# EasyEDA Pro project ProDoc_PCB1_2024-07-10.epro

# Board PCB1
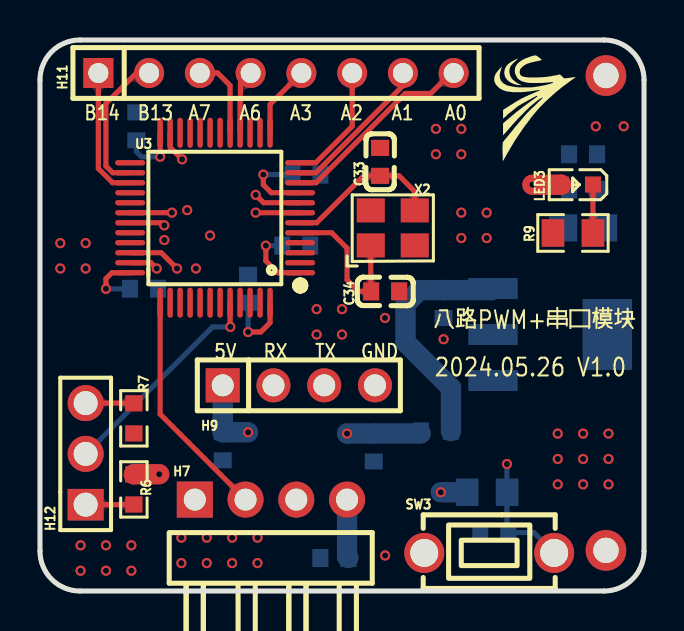
[diagram p0: board, top side]
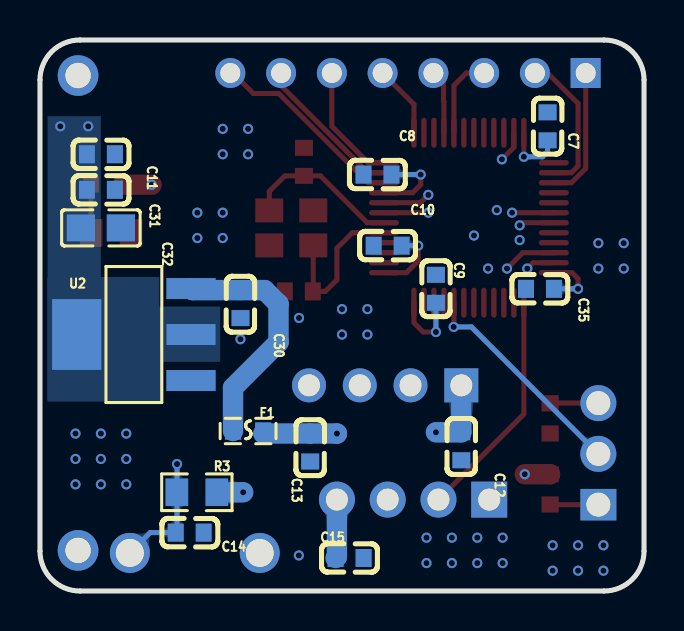
[diagram p1: board, bottom side, seen from below]

Outline 30.23 x 27.56 mm; copper layers: Top Layer, Inner1, Inner2, Bottom Layer. Coordinates in mm from the lower left corner of the outline.
Outline path: 0,25.56 0,2 arc(0.59,0.59) 2,0 28.23,0 arc(29.64,0.59) 30.23,2 30.23,25.56 arc(29.64,26.97) 28.23,27.56 2,27.56 arc(0.59,26.97) 0,25.56
Stack: Top Layer 0.035mm 外层铜厚1oz / Dielectric1 0.2104mm 7628 RC49% 8.6mil / Inner1 0.0152mm 内层铜厚 / Dielectric2 1.065mm 1.1mm H/HOZ 含铜 / Inner2 0.0152mm 内层铜厚 / Dielectric3 0.2104mm 7628 RC49% 8.6mil / Bottom Layer 0.035mm 外层铜厚1oz

## Design rules (mm)
net OSC_IN: DP1
net OSC_OUT: DP1
template: JLCPCB Capability(Two Layers Board)
spacing copperThickness1oz (default): track to track 0.102, other pairs 0.152 to 0.3
spacing copperThickness2oz: track to track 0.203, other pairs 0.152 to 0.3
track width copperThickness1oz (default): min 0.127, default 0.254, max 2.54
track width copperThickness2oz: min 0.203, default 0.254, max 2.54
differential pair differentialPair (default): width min 0.127, default 0.254, max 2.54; gap min 0.152, default 0.152
via viaSize (default): diameter min 0.5, default 0.61, max 10; hole min 0.3, default 0.305, max 6.3

## Placement (name value [footprint] x y rotation side)
C7  100nF  [C0603]  4.83 23.24 270 bottom
C8  100nF  [C0603]  13.34 20.83 180 bottom
C9  100nF  [C0603]  10.41 15.11 270 bottom
C10  100nF  [C0603]  12.83 17.27 180 bottom
C11  22uF  [C0603]  27.18 21.84 0 bottom
C12  22uF  [C0603]  9.14 7.24 90 bottom
C13  100nF  [C0603]  16.7 7.18 90 bottom
C14  100nF  [C0603]  22.73 2.92 0 bottom
C15  100nF  [C0603]  14.73 1.65 180 bottom
C30  100nF  [C0603]  20.19 14.35 90 bottom
C31  100nF  [C0603]  27.18 20.07 0 bottom
C32  10uF  [C0805]  27.18 18.16 0 bottom
C33  20pF  [C0603]  17.02 21.46 270 top
C34  20pF  [C0603]  17.27 14.99 180 top
C35  100nF  [C0603]  5.21 15.11 180 bottom
F1  ASMD0603-035  [F0603]  19.81 8 0 bottom
H7  2.54-1*4P反弯排针  [HDR-TH_4P-P2.54-H-M-W10.4]  11.56 4.57 0 top
H9  PZ254V-11-04P  [HDR-TH_4P-P2.54-V-M]  12.95 10.29 0 top
H11  PZ254V-11-08P  [HDR-TH_8P-P2.54-V-M]  11.81 25.91 0 top
H12  2.54-1*3P针  [HDR-TH_3P-P2.54-V-M-1]  2.29 6.86 90 top
LED3  NCD0603R1  [LED0603-RD_RED]  26.87 20.33 180 top
NOREF  -  [Pad_e3583]  28.32 2.03 0 top
NOREF#2  -  [Pad_e3581]  28.32 25.78 0 top
R3  10kΩ  [R0805]  22.38 4.94 180 bottom
R6  10kΩ  [R0603]  4.7 5.08 90 top
R7  10kΩ  [R0603]  4.7 8.64 90 top
R9  1kΩ  [R0805]  26.67 17.91 0 top
SW3  UK-B0205G43-DP25Y  [KEY-TH_L6.0-W3.5-P6.50]  22.48 1.91 0 top
U2  SK1117-3.3  [SOT-223_L6.5-W3.5-P2.30-LS7.0-BR]  25.53 12.83 180 bottom
U3  STM32L051C8T6  [LQFP-48_L7.0-W7.0-P0.50-LS9.0-BL]  8.76 18.67 90 top
X2  8MHz  [OSC-SMD_4P-L3.2-W2.5-BL]  17.65 18.16 0 top

## Footprints (pads in the part's own frame, mm; a bottom-side part is the same pattern mirrored in y, then rotated)
C0603
  rect 0.8x0.9 smd: 1(-0.7,0) 2(0.7,0)
C0805
  rect 1.41x1.35 smd: 1(-1,0) 2(1,0)
F0603
  rect 0.806x0.864 smd: 1(-0.753,0) 2(0.753,0)
HDR-TH_3P-P2.54-V-M-1
  rect 1.575x1.8 hole 1.2: 1(-2.54,0)
  round 1.8 hole 1.2: 2(0,0) 3(2.54,0)
HDR-TH_4P-P2.54-H-M-W10.4
  rect 1.8x1.8 hole 1.1: 1(-3.81,0)
  round 1.8 hole 1.1: 2(-1.27,0) 3(1.27,0) 4(3.81,0)
HDR-TH_4P-P2.54-V-M
  rect 1.7x1.7 hole 1.1: 1(-3.81,0)
  round 1.7 hole 1.1: 2(-1.27,0) 3(1.27,0) 4(3.81,0)
HDR-TH_8P-P2.54-V-M
  rect 1.5x1.5 hole 1: 1(-8.89,0)
  round 1.5 hole 1: 2(-6.35,0) 3(-3.81,0) 4(-1.27,0) 5(1.27,0) 6(3.81,0) 7(6.35,0) 8(8.89,0)
KEY-TH_L6.0-W3.5-P6.50
  round 2 hole 1.4: 1(-3.25,0) 2(3.25,0)
LED0603-RD_RED
  rect 0.8x0.8 smd: 1(-0.799,-0.004) 2(0.799,0.004)
LQFP-48_L7.0-W7.0-P0.50-LS9.0-BL
  oval 0.27x1.5 smd: 1(-2.75,-4.25) 2(-2.25,-4.25) 3(-1.75,-4.25) 4(-1.25,-4.25) 5(-0.75,-4.25) 6(-0.25,-4.25) 7(0.25,-4.25) 8(0.75,-4.25) 9(1.25,-4.25) 10(1.75,-4.25) 11(2.25,-4.25) 12(2.75,-4.25) 25(2.75,4.25) 26(2.25,4.25) 27(1.75,4.25) 28(1.25,4.25) 29(0.75,4.25) 30(0.25,4.25) 31(-0.25,4.25) 32(-0.75,4.25) 33(-1.25,4.25) 34(-1.75,4.25) 35(-2.25,4.25) 36(-2.75,4.25)
  oval 1.5x0.27 smd: 13(4.25,-2.75) 14(4.25,-2.25) 15(4.25,-1.75) 16(4.25,-1.25) 17(4.25,-0.75) 18(4.25,-0.25) 19(4.25,0.25) 20(4.25,0.75) 21(4.25,1.25) 22(4.25,1.75) 23(4.25,2.25) 24(4.25,2.75) 37(-4.25,2.75) 38(-4.25,2.25) 39(-4.25,1.75) 40(-4.25,1.25) 41(-4.25,0.75) 42(-4.25,0.25) 43(-4.25,-0.25) 44(-4.25,-0.75) 45(-4.25,-1.25) 46(-4.25,-1.75) 47(-4.25,-2.25) 48(-4.25,-2.75)
OSC-SMD_4P-L3.2-W2.5-BL
  rect 1.4x1.2 smd: 1(-1.1,-0.875) 2(1.1,-0.875) 3(1.1,0.875) 4(-1.1,0.875)
Pad_e3581
  round 2.032 hole 1.27: 1(0,0)
Pad_e3583
  round 2.032 hole 1.27: 1(0,0)
R0603
  rect 0.806x0.864 smd: 1(-0.753,0) 2(0.753,0)
R0805
  rect 1.133x1.377 smd: 1(-1,0) 2(1,0)
SOT-223_L6.5-W3.5-P2.30-LS7.0-BR
  rect 2.465x1.05 smd: 1(2.857,-2.3) 2(2.857,0) 3(2.857,2.3)
  rect 2.465x3.54 smd: 4(-2.857,0)

## Nets
3V3: C7.2 C8.2 C9.2 C10.2 C11.2 C15.1 C31.2 C32.2 C35.2 H7.4 LED3.2 R3.2 R6.2 U2.2 U2.4 U3.1 U3.9 U3.24 U3.36 U3.48
+5V: C12.2 C13.2 F1.1 H9.1
GND: C7.1 C8.1 C9.1 C10.1 C11.1 C12.1 C13.1 C14.1 C15.2 C30.1 C31.1 C32.1 C33.1 C34.1 C35.1 H7.1 H9.4 NOREF.1 NOREF#2.1 R7.1 R9.1 SW3.1 U2.1 U3.8 U3.23 U3.35 U3.47 X2.2 X2.4
BOOT0: H12.2 U3.44
NRST: C14.2 R3.1 SW3.2 U3.7
OSC_IN: C34.2 U3.5 X2.1
OSC_OUT: C33.2 U3.6 X2.3
PA0: H11.8 U3.10
PA1: H11.7 U3.11
PA2: H11.6 U3.12
PA3: H11.5 U3.13
PA6: H11.4 U3.16
PA7: H11.3 U3.17
PA9: H9.3 U3.30
PA10: H9.2 U3.31
PA13: H7.3 U3.34
PA14: H7.2 U3.37
PB13: H11.2 U3.26
PB14: H11.1 U3.27
$1N2833: C30.2 F1.2 U2.3
$1N2835: LED3.1 R9.2
$1N5934: H12.1 R6.1
$1N5935: H12.3 R7.2

Pads without a net: U3 2 3 4 14 15 18 19 20 21 22 25 28 29 32 33 38 39 40 41 42 43 45 46

## Via types
v1: diameter 0.508, hole 0.305, Top Layer to Bottom Layer, 67 vias

## Routing (per net, layer and track width the routed paths; a pad name or vN(x,y) marks a point on that pad's centre or on a via; arc(x,y) is an arc through that point)
3V3: length 24.4
  Top Layer w0.254: U3.1 11.89,15.92 11.3,16.51 v1(11.3,17.27) ; U3.24 v1(6.01,21.72) ; v1(11.18,20.83) 11.18,20.32 11.58,19.92 U3.9 ; U3.48 11.51,13.42 11.05,12.95 v1(10.41,12.95) ; U3.36 3.6,15.92 3.3,15.62 v1(3.3,15.11)
  Top Layer w1.016: v1(5.97,5.84) 4.71,5.84 R6.2 ; LED3.2 26.07,20.32 v1(24.64,20.32)
  Bottom Layer w0.254: 4.63,15.11 v1(3.3,15.11) ; 12.51,20.83 v1(11.18,20.83) ; C7.2 4.83,21.97 5.08,21.72 v1(6.01,21.72) ; C9.2 v1(10.41,12.95) ; C10.2 v1(11.3,17.27)
  Bottom Layer w1.016: H7.4 15.37,1.72 C15.1 ; R3.2 v1(20.06,4.94)
  vias: v1(27.81,23.24) v1(29.21,23.24)
+5V: length 7.3
  Bottom Layer w1.016: 19.05,7.88 C13.2 15.37,7.88 v1(15.37,7.87) ; H9.1 9.14,7.94 v1(10.41,7.94)
GND: length 5.4
  Top Layer w0.254: v1(7.11,21.59) 6.51,22.19 U3.23 ; v1(5.84,16.13) 5.55,16.42 U3.35 ; v1(10.8,19.81) 11.19,19.42 U3.8
  vias: v1(1.02,17.4) v1(1.02,16.13) v1(2.03,2.29) v1(2.03,1.02) v1(2.29,17.4) v1(2.29,16.13) v1(3.3,2.29) v1(3.3,1.02) v1(4.57,2.29) v1(4.57,1.02) v1(6.22,17.55) v1(7.08,2.67) v1(7.08,1.4) v1(7.37,19.05) v1(7.81,16.13) v1(8.34,2.67) v1(8.34,1.4) v1(8.51,17.78) v1(9.62,2.67) v1(9.62,1.4) v1(10.89,2.67) v1(10.89,1.4) v1(13.84,14.1) v1(13.84,12.83) v1(15.11,14.1) v1(15.11,12.83) v1(17.26,13.66) v1(17.27,1.78) v1(19.81,23.11) v1(19.81,21.84) v1(20.2,12.59) v1(21.08,23.11) v1(21.08,21.84) v1(21.08,18.92) v1(21.08,17.65) v1(22.35,18.92) v1(22.35,17.65) v1(25.91,7.87) v1(25.91,6.6) v1(25.91,5.33) v1(27.18,7.87) v1(27.18,6.6) v1(27.18,5.33) v1(28.45,7.87) v1(28.45,6.6) v1(28.45,5.33)
BOOT0: length 11.1
  Top Layer w0.254: v1(9.53,13.21) 9.51,13.22 U3.44
  Bottom Layer w0.254: H12.2 8.64,13.21 v1(9.53,13.21)
NRST: length 29.1
  Top Layer w0.254: U3.7 10.8,18.92 v1(10.8,18.92)
  Inner1 w0.254: v1(10.8,18.92) 15.62,18.92 23.37,11.18 v1(23.37,6.35)
  Bottom Layer w0.254: 23.37,4.95 23.37,2.92 24.71,2.92 SW3.2 ; 23.37,4.95 R3.1 ; 23.37,4.95 v1(23.37,6.35)
OSC_IN: length 8
  Top Layer w0.254: U3.5 14.59,17.92 15.37,17.14 15.37,15.56 15.95,14.99 16.55,14.99 X2.1
OSC_OUT: length 8
  Top Layer w0.254: X2.3 18.75,19.98 17.97,20.76 C33.2 16.19,20.76 13.85,18.42 U3.6
PA0: length 10
  Top Layer w0.254: U3.10 13.81,20.42 18.28,24.89 19.55,24.89 20.57,25.91 H11.8
PA1: length 7.6
  Top Layer w0.254: H11.7 18.16,25.27 13.81,20.92 U3.11
PA2: length 6
  Top Layer w0.254: U3.12 13.8,21.42 15.62,23.24 H11.6
PA3: length 3.6
  Top Layer w0.254: H11.5 11.51,24.34 U3.13
PA6: length 3.2
  Top Layer w0.254: U3.16 10.01,24.49 10.03,24.51 10.03,25.4 H11.4
PA7: length 4.1
  Top Layer w0.254: H11.3 8.89,25.91 9.51,25.28 U3.17
PA9: length 13.9
  Top Layer w0.254: U3.30 4.52,18.92 v1(6.6,18.92)
  Inner1 w0.254: v1(6.6,18.92) 14.22,11.3 H9.3
PA10: length 12.3
  Top Layer w0.254: U3.31 6.09,18.42 v1(6.22,18.29)
  Inner1 w0.254: v1(6.22,18.29) 6.73,18.29 11.68,13.33 H9.2
PA13: length 17.1
  Top Layer w0.254: v1(6.86,16.13) 6.07,16.92 U3.34
  Inner1 w0.254: v1(6.86,16.13) 6.86,9.91 12.19,4.57 H7.3
PA14: length 11.6
  Top Layer w0.254: U3.37 6.01,8.85 H7.2
PB13: length 7.3
  Top Layer w0.254: U3.26 3.64,20.92 3.3,21.25 3.3,24.38 4.83,25.91 H11.2
PB14: length 6.7
  Top Layer w0.254: H11.1 2.92,21.13 3.63,20.42 U3.27
$1N2833: length 12
  Bottom Layer w1.016: F1.2 20.57,10.17 18.29,12.45 18.29,14.35 18.99,15.05 C30.2 22.59,15.05 U2.3
$1N2835: length 2.4
  Top Layer w0.254: 27.67,17.91 LED3.1
$1N5934: length 2.4
  Top Layer w0.254: H12.1 4.69,4.32 R6.1
$1N5935: length 2.4
  Top Layer w0.254: H12.3 4.69,9.4 R7.2

## Copper pours and planes (outline as drawn; the poured copper is in the pictures)
3V3 on Bottom Layer: 21.21,15.7 29.85,15.7 29.85,9.47 21.21,9.47
3V3 on Bottom Layer: 27.18,23.75 29.84,23.75 29.84,9.52 27.18,9.52
3V3 on Inner2: 0,27.56 30.1,27.56 30.1,0 0,0
+5V on Inner2: 7.62,11.81 20.07,11.81 20.07,5.84 7.62,5.84
GND on Top Layer: 0,27.56 30.1,27.56 30.1,0 0,0
GND on Bottom Layer: 0,27.56 30.1,27.56 30.1,0 0,0
GND on Inner1: 0,27.56 30.1,27.56 30.1,0 0,0

Small or netless copper shapes (teardrops, artwork), in the pictures only: 53 on Top Layer, 21 on Bottom Layer, 8 on Inner1

## Text on the board
Top Silkscreen Layer: B14 | B13 | A7 | 5V | A6 | RX | A3 | TX | A2 | GND | A1 | A0 | 2024.05.26 V1.0 | 八路PWM+串口模块
